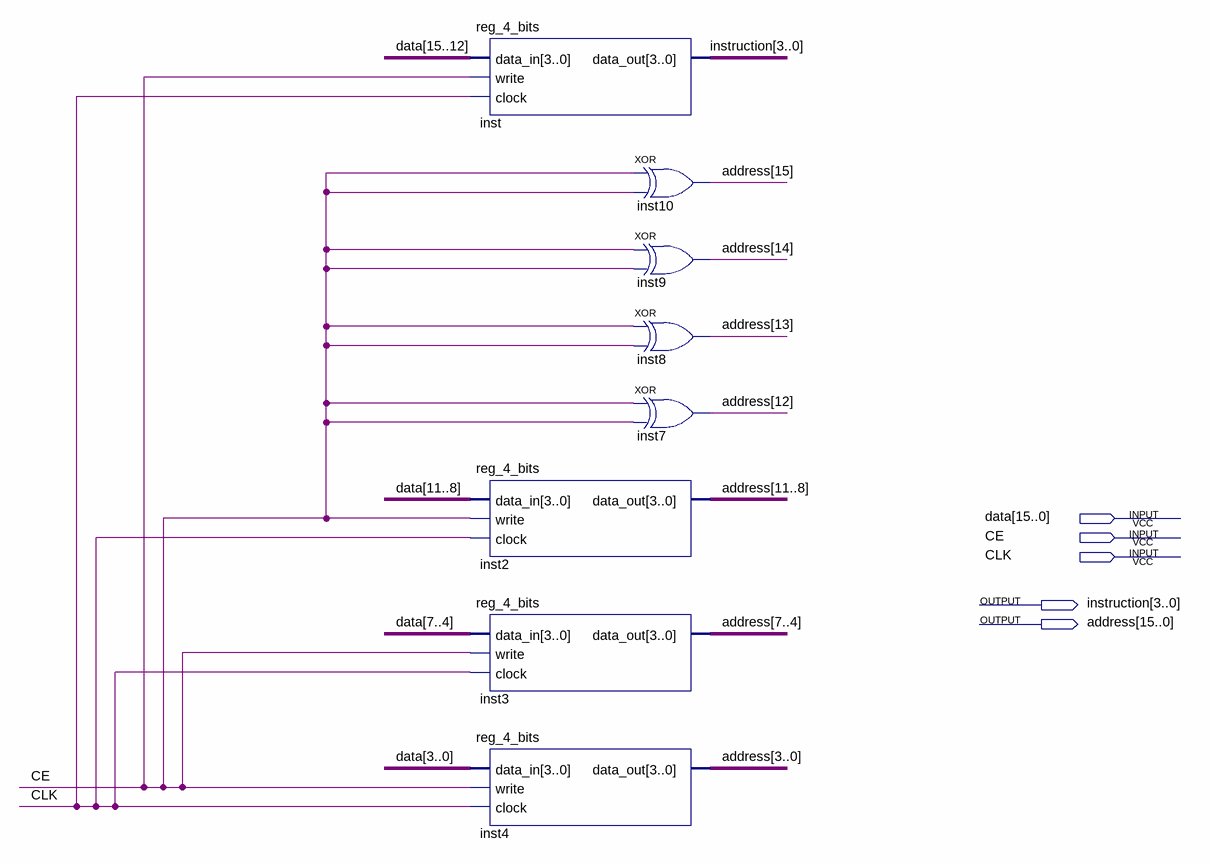
[diagram p0: schematic sheet]
// Quartus schematic reg_ir.bdf as structural Verilog: 8 symbols, 5 pins
module reg_ir (
  input  [15:0] data,
  input  CE,
  input  CLK,
  output [3:0] instruction,
  output [15:0] address
);

  reg_4_bits inst (.data_in(data[15:12]), .write(CE), .clock(CLK), .data_out(instruction));
  reg_4_bits inst2 (.data_in(data[11:8]), .write(CE), .clock(CLK), .data_out(address[11:8]));
  reg_4_bits inst3 (.data_in(data[7:4]), .write(CE), .clock(CLK), .data_out(address[7:4]));
  reg_4_bits inst4 (.data_in(data[3:0]), .write(CE), .clock(CLK), .data_out(address[3:0]));
  xor inst10 (address[15], CE, CE);
  xor inst9 (address[14], CE, CE);
  xor inst8 (address[13], CE, CE);
  xor inst7 (address[12], CE, CE);
endmodule
